# Altium schematic sheet Mosfet_SSR.SchDoc
size A; SheetNumber: 2; SheetTotal: 3
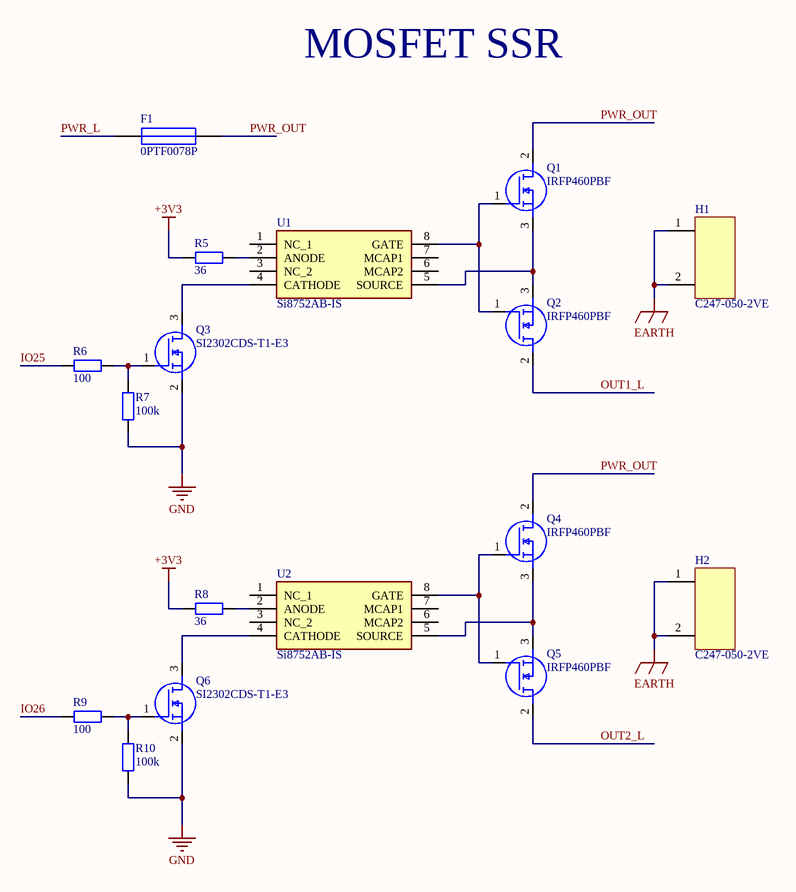
[diagram p0: Mosfet_SSR.SchDoc]

## Parts
F1  0PTF0078P  [FH1-200CK-B]
H1  C247-050-2VE  [C247-050-2VE]
H2  C247-050-2VE  [C247-050-2VE]
Q1  IRFP460PBF  [TO546P531X1558X2511-3P]
Q2  IRFP460PBF  [TO546P531X1558X2511-3P]
Q3  SI2302CDS-T1-E3  [SOT95P237X112-3N]
Q4  IRFP460PBF  [TO546P531X1558X2511-3P]
Q5  IRFP460PBF  [TO546P531X1558X2511-3P]
Q6  SI2302CDS-T1-E3  [SOT95P237X112-3N]
R5  36  [R2012_0805I_N]
R6  100  [R2012_0805I_N]
R7  100k  [R2012_0805I_N]
R8  36  [R2012_0805I_N]
R9  100  [R2012_0805I_N]
R10  100k  [R2012_0805I_N]
U1  Si8752AB-IS  [SOIC127P600X175-8N]
U2  Si8752AB-IS  [SOIC127P600X175-8N]

## Nets
+3V3: R5.2 R8.2
EARTH: H1.1 H1.2 H2.1 H2.2
GND: Q3.2(S) Q6.2(S) R7.1 R10.1
IO25: R6.2
IO26: R9.2
OUT1_L: Q2.2(D)
OUT2_L: Q5.2(D)
PWR_L: F1.1
PWR_OUT: F1.2 Q1.2(D) Q4.2(D)
NetQ1_1: Q1.1(G) Q2.1(G) U1.8(GATE)
NetQ1_3: Q1.3(S) Q2.3(S) U1.5(SOURCE)
NetQ3_1: Q3.1(G) R6.1 R7.2
NetQ3_3: Q3.3(D) U1.4(CATHODE)
NetQ4_1: Q4.1(G) Q5.1(G) U2.8(GATE)
NetQ4_3: Q4.3(S) Q5.3(S) U2.5(SOURCE)
NetQ6_1: Q6.1(G) R9.1 R10.2
NetQ6_3: Q6.3(D) U2.4(CATHODE)
NetR5_1: R5.1 U1.2(ANODE)
NetR8_1: R8.1 U2.2(ANODE)

Not connected (* = marked no-connect by the designer): U1 1(NC_1) 3(NC_2) 6(MCAP2) 7(MCAP1); U2 1(NC_1) 3(NC_2) 6(MCAP2) 7(MCAP1)

## Notes on the sheet
- MOSFET SSR

## Library data of the parts
F1 = 0PTF0078P: Fuse holder; Manufacturer_Name: LITTELFUSE; Datasheet Link: https://media.digikey.com/pdf/Data%20Sheets/Littelfuse%20PDFs/PTF075_77_78.pdf; Height: 11.5mm; Manufacturer_Part_Number: 0PTF0078P; Mouser Part Number: 576-0PTF0078P; Mouser Price/Stock: https://www.mouser.co.uk/ProductDetail/Littelfuse/0PTF0078P?qs=Co4VkB5J4%2Fsczy6gG8s%2FsA%3D%3D; Arrow Part Number: 0PTF0078P; Arrow Price/Stock: https://www.arrow.com/en/products/0ptf0078p/littelfuse?region=nac
H1 H2 = C247-050-2VE: Heatsink
Q1 Q2 Q4 Q5 = IRFP460PBF: MOSFET (N-Channel); Manufacturer_Name: Vishay; Datasheet Link: http://www.vishay.com/docs/91237/91237.pdf; Height: 5.31mm; Manufacturer_Part_Number: IRFP460PBF; Mouser Part Number: 844-IRFP460PBF; Mouser Price/Stock: https://www.mouser.co.uk/ProductDetail/Vishay-Semiconductors/IRFP460PBF?qs=%2FRKvNCQzLu1lHqVRTT%2Fu6Q%3D%3D; Arrow Part Number: IRFP460PBF; Arrow Price/Stock: https://www.arrow.com/en/products/irfp460pbf/vishay?region=nac
Q3 Q6 = SI2302CDS-T1-E3: MOSFET (N-Channel); Manufacturer_Name: Vishay; Datasheet Link: https://labcenter.componentsearchengine.com/Datasheets/2/SI2302CDS-T1-E3.pdf; Height: 1.12mm; Manufacturer_Part_Number: SI2302CDS-T1-E3; Mouser Part Number: 781-SI2302CDS-E3; Mouser Price/Stock: https://www.mouser.co.uk/ProductDetail/Vishay-Semiconductors/SI2302CDS-T1-E3?qs=%252BPu8jn5UVnHNrjAmGCs%2Fuw%3D%3D; Arrow Part Number: SI2302CDS-T1-E3; Arrow Price/Stock: https://www.arrow.com/en/products/si2302cds-t1-e3/vishay
R5-R10 = R
  R5 R8: Value: 36
  R6 R9: Value: 100
  R7 R10: Value: 100k
U1 U2 = Si8752AB-IS: Integrated Circuit; Manufacturer_Name: Silicon Labs; Datasheet Link: https://datasheet.datasheetarchive.com/originals/distributors/DKDS-19/378558.pdf; Height: 1.75mm; Manufacturer_Part_Number: Si8752AB-IS; Mouser Part Number: 634-SI8752AB-IS; Mouser Price/Stock: https://www.mouser.co.uk/ProductDetail/Silicon-Labs/SI8752AB-IS?qs=j6MGy4L9yX1nnSxizYyoBA%3D%3D; Arrow Part Number: SI8752AB-IS; Arrow Price/Stock: https://www.arrow.com/en/products/si8752ab-is/silicon-labs